# Altium project kookwekker.PrjPcb
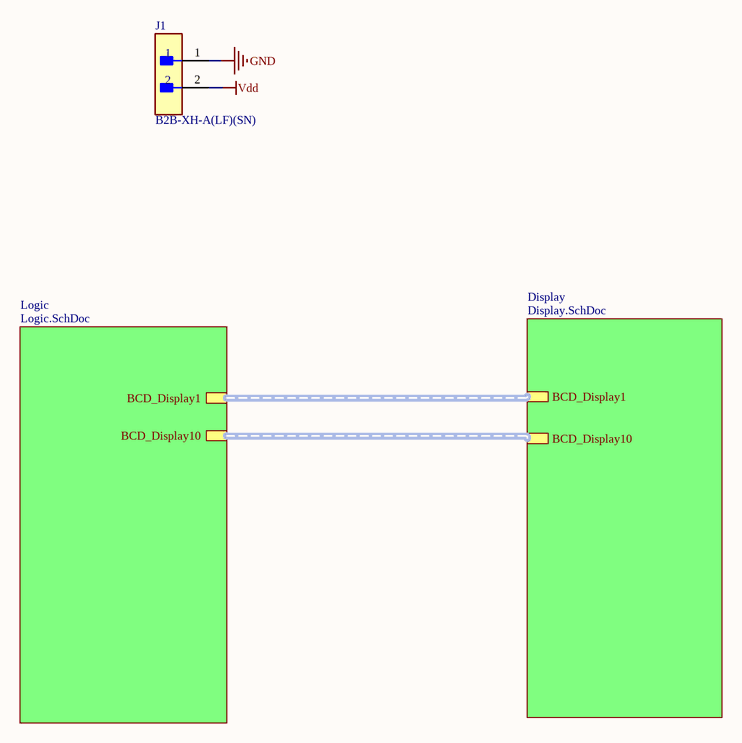
[diagram p0: KookWekker.SchDoc]
3 sheets, 36 parts. Net scope: hierarchical (ports join the sheet entries above them; power ports are global).
Board files: PCB2.PcbDoc, PCB1.PcbDoc
Sheets:
  KookWekker.SchDoc
    Logic = Logic.SchDoc
    Display = Display.SchDoc

## Sheet KookWekker.SchDoc: Kookwekker
size A4; Author: Fabian Eppens; DrawnBy: Fabian Eppens; Revision: 1.0; SheetNumber: 1; SheetTotal: 3

### Parts
J1  B2B-XH-A(LF)(SN)  [FP-B2B-XH-A_LF_SN-MFG]

### Sub-sheets
Display = Display.SchDoc: BCD_Display1 (harness BCD1), BCD_Display10 (harness BCD10)
Logic = Logic.SchDoc: BCD_Display1 (harness BCD1), BCD_Display10 (harness BCD10)

### Nets
GND: J1.1
Vdd: J1.2

### Buses and harness runs
harness sheet Display/BCD_Display1 = sheet Logic/BCD_Display1
harness sheet Display/BCD_Display10 = sheet Logic/BCD_Display10

### Notes on the sheet
- Size:
- Date:
- Drawn by:
- Revision:
- Hogeschool Windesheim
- Campus 2-6
- Postbus 10090
- A4
- Sheet
- of
- 8000GB, Zwolle

### Library data of the parts
J1 = CMP-2000-05888-3: CONN HEADER VERT 2POS 2.5MM; Current Rating: 3A; Voltage Rating: 250V; Number of Contacts: 2; Contact Resistance: 20mR; Wire/Cable Gauge: 22AWG; Insulation Resistance: 1GR; Connector Type: Male Pin; Packaging: Bulk; Contact Material: Brass; Lead Free: Lead Free; Orientation: Straight; Contact Plating: Tin; Max Current Rating: 3A; Termination: Solder; Fastening Type: Detent; Depth: 5.75mm; Housing Material: Polyamide; REACH SVHC: No SVHC; Series: XH; Voltage Rating (AC): 250V; Number of Positions: 2; Color: Natural; Contact Type: Male Pin; Max Voltage Rating (DC): 250V; Pitch: 2.5mm; Lead Pitch: 2.5mm; Mount: Through Hole; Max Operating Temperature: 85°C; Length: 7.4mm; Max Voltage Rating (AC): 250V; Min Operating Temperature: -25°C; Number of Rows: 1; Housing Color: White

## Sheet Logic.SchDoc: Kookwekker
size A4; Author: Fabian Eppens; DrawnBy: Fabian Eppens; Revision: 1.0; SheetNumber: 2; SheetTotal: 3
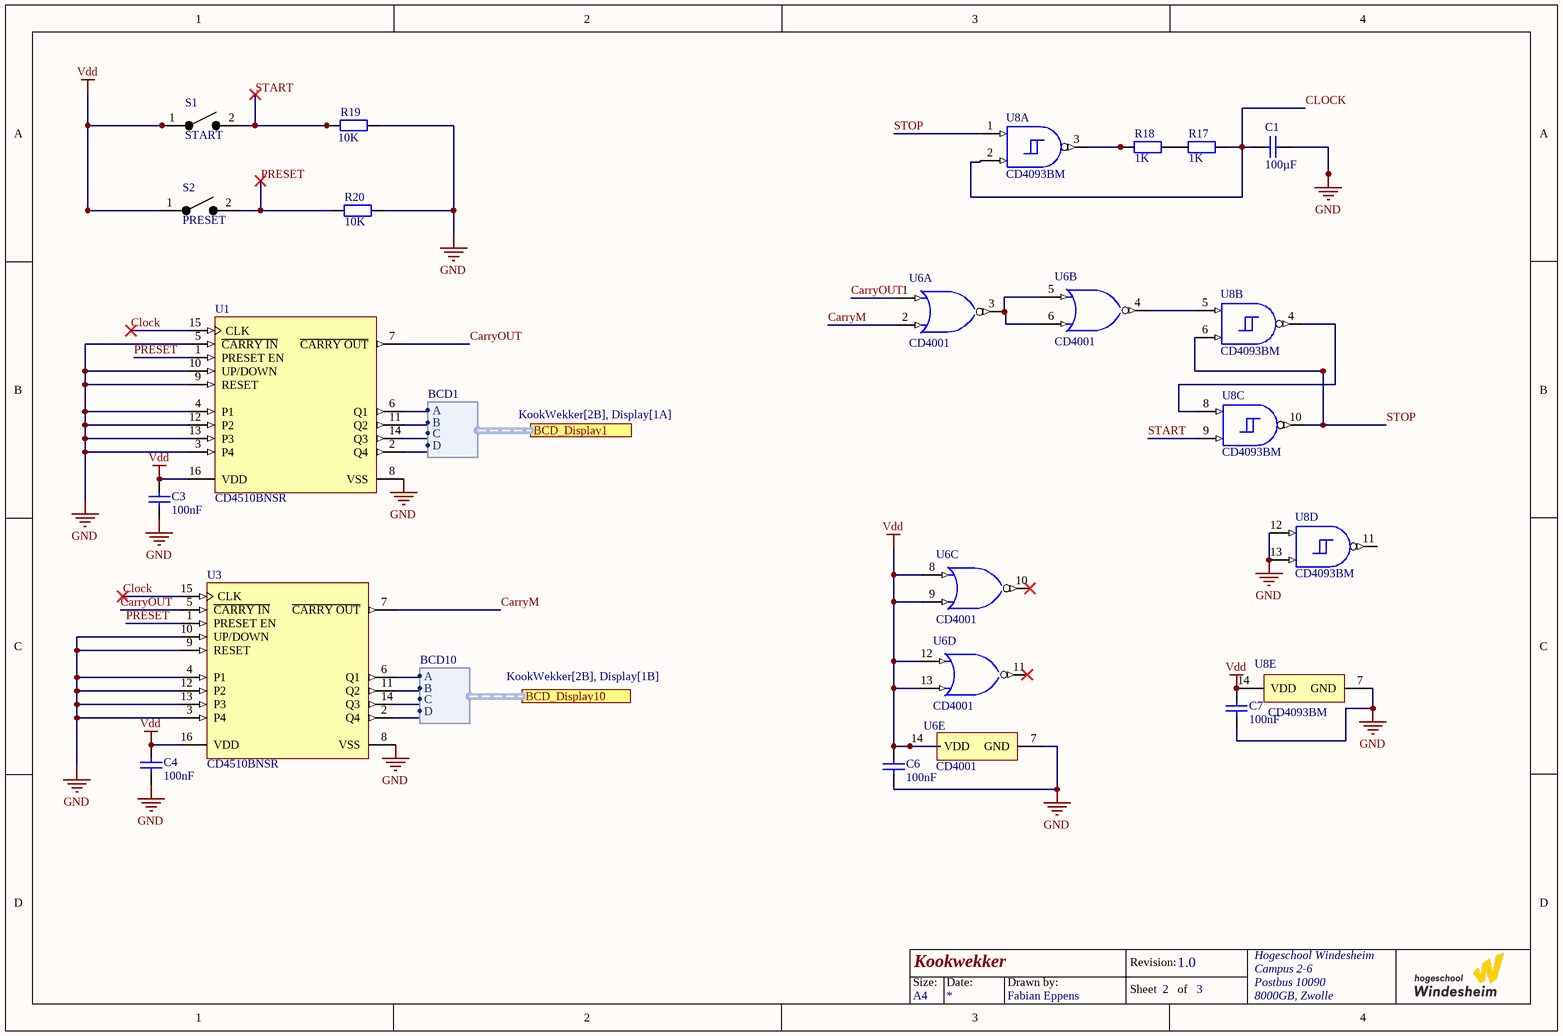
[diagram p1: Logic.SchDoc]

### Parts
C1  100µF  [C1206]
C3  100nF  [C1206]
C4  100nF  [C1206]
C6  100nF  [C1206]
C7  100nF  [C1206]
R17  1K  [R1206]
R18  1K  [R1206]
R19  10K  [R1206]
R20  10K  [R1206]
S1  START  [1478731]
S2  PRESET  [1478731]
U1  CD4510BNSR  [NS0016A_N]
U3  CD4510BNSR  [NS0016A_N]
U6  CD4001  [D0014A_N]  (parts A,B,C,D,E of 5)
U8  CD4093BM  [D0014A_N]  (parts A,B,C,D,E of 5)

### Ports
BCD_Display1 (harness BCD1, see KookWekker[2B], Display[1A]), BCD_Display10 (harness BCD10, see KookWekker[2B], Display[1B])

### Harnesses
BCD1: A, B, C, D
BCD10: A, B, C, D

### Nets
GND: C1.2 C3.2 C4.2 C6.1 C7.1 R19.2 R20.2 U1.3(P4) U1.4(P1) U1.5(~{CARRY_IN}) U1.8(VSS) U1.9(RESET) U1.10(UP/DOWN) U1.12(P2) U1.13(P3) U3.3(P4) U3.4(P1) U3.8(VSS) U3.9(RESET) U3.10(UP/DOWN) U3.12(P2) U3.13(P3) U6.7(GND) U8.7(GND) U8.12(G) U8.13(H)
Vdd: C3.1 C4.1 C6.2 C7.2 S1.1 S2.1 U1.16(VDD) U3.16(VDD) U6.8(E) U6.9(F) U6.12(G) U6.13(H) U6.14(VDD) U8.14(VDD)
CarryM: U3.7(~{CARRY_OUT}) U6.2(B)
CarryOUT: U1.7(~{CARRY_OUT}) U3.5(~{CARRY_IN}) U6.1(A)
Clock: C1.1 R17.2 U1.15(CLK) U3.15(CLK) U8.2(B)
PRESET: R20.1 S2.2 U1.1(PRESET_EN) U3.1(PRESET_EN)
START: R19.1 S1.2 U8.9(F)
STOP: U8.1(A) U8.6(D) U8.10(L)
NetR17_1: R17.1 R18.2
NetR18_1: R18.1 U8.3(J)
NetU1_2: U1.2(Q4) ; port BCD_Display1.D
NetU1_6: U1.6(Q1) ; port BCD_Display1.A
NetU1_11: U1.11(Q2) ; port BCD_Display1.B
NetU1_14: U1.14(Q3) ; port BCD_Display1.C
NetU3_2: U3.2(Q4) ; port BCD_Display10.D
NetU3_6: U3.6(Q1) ; port BCD_Display10.A
NetU3_11: U3.11(Q2) ; port BCD_Display10.B
NetU3_14: U3.14(Q3) ; port BCD_Display10.C
NetU6_3: U6.3(J) U6.5(C) U6.6(D)
NetU6_4: U6.4(K) U8.5(C)
NetU8_4: U8.4(K) U8.8(E)

Not connected (* = marked no-connect by the designer): U6 10(L)* 11(M)*; U8 11(M)

### Notes on the sheet
- Size:
- Date:
- Drawn by:
- Revision:
- Hogeschool Windesheim
- Campus 2-6
- Postbus 10090
- A4
- Sheet
- of
- 8000GB, Zwolle

### Library data of the parts
C1 C3 C4 C6 C7 = Capacitor_1206: SMD Capacitor 1206; Published: 03-11-2016; LatestRevisionDate: 03-11-2016; LatestRevisionNote: Creation; PackageReference: C1206; Publisher: Windesheim; PackageDescription: Chip Capacitor, Body 3.2x1.6mm, Height 1.7mm, IPC Medium Density
  C1: Value: 100µF
  C3 C4 C6 C7: Value: 100nF
R17-R20 = Resistor_1206: SMD Resistor 1206; Published: 03-11-2016; LatestRevisionDate: 03-11-2016; LatestRevisionNote: Creation; PackageReference: R1206; Publisher: Windesheim; PackageDescription: Chip Resistor, Body 3.2x1.6mm, IPC Medium Density
  R17 R18: Value: 1K
  R19 R20: Value: 10K
S1 S2 = Switch: Manufacturer_Name: TE Connectivity; Manufacturer_Part_Number: 147873-1; Datasheet Link: https://componentsearchengine.com/Datasheets/1/147873-1.pdf; Height: 5mm; Mouser Part Number: 506-147873-1; Mouser Price/Stock: https://www.mouser.com/Search/Refine.aspx?Keyword=506-147873-1
U1 U3 = CD4510BNSR: CMOS Presettable BCD Up/Down Counter, NS0016A, LARGE T&R; Manufacturer: Texas Instruments; Bits(#): 4; VCC(Min)(V): 3; Voltage(Nom)(V): 5,10,15; Schmitt Trigger: No; Output Drive (IOL/IOH)(Max)(mA): 1.5/-1.5; Rating: Catalog; Inputs: 1; VCC(Max)(V): 18; Technology Family: CD4000; F @ Nom Voltage(Max)(Mhz): 8; ICC @ Nom Voltage(Max)(mA): 0.03; tpd @ Nom Voltage(Max)(ns): 200; PackageReference: NS0016A; DatasheetVersion: SCHS071B; Generic Part Number: CD4510B; Operating Temperature Range(C): -55 to 125; Output Type: CMOS; Input Type: CMOS; Type: Other; Function: Counter
U6 = CD4001: CMOS Quad 2-Input NOR Schmitt Triggers, D0014A, TUBE; Generic Part Number: CD4093B; Manufacturer: Texas Instruments; Output Drive (IOL/IOH)(Max)(mA): 1.5/-1.5; VCC(Min)(V): 3; Rating: Catalog; Schmitt Trigger: Yes; Voltage(Nom)(V): 10; F @ Nom Voltage(Max)(Mhz): 8; ICC @ Nom Voltage(Max)(mA): 0.06; Bits(#): 4; VCC(Max)(V): 18; Technology Family: CD4000; DatasheetVersion: SCHS115D; Code_JEDEC: MS-012; Operating Temperature Range(C): -55 to 125; Output Type: CMOS; PackageReference: D0014A; Input Type: CMOS
U8 = CD4093BM: CMOS Quad 2-Input NAND Schmitt Triggers, D0014A, TUBE; Manufacturer: Texas Instruments; Output Drive (IOL/IOH)(Max)(mA): 1.5/-1.5; VCC(Min)(V): 3; Rating: Catalog; Schmitt Trigger: Yes; Voltage(Nom)(V): 10; F @ Nom Voltage(Max)(Mhz): 8; ICC @ Nom Voltage(Max)(mA): 0.06; Bits(#): 4; VCC(Max)(V): 18; Technology Family: CD4000; Generic Part Number: CD4093B; DatasheetVersion: SCHS115D; Code_JEDEC: MS-012; Operating Temperature Range(C): -55 to 125; Output Type: CMOS; PackageReference: D0014A; Input Type: CMOS

## Sheet Display.SchDoc: Kookwekker
size A4; Author: Fabian Eppens; DrawnBy: Fabian Eppes; Revision: 1.0; SheetNumber: 3; SheetTotal: 3
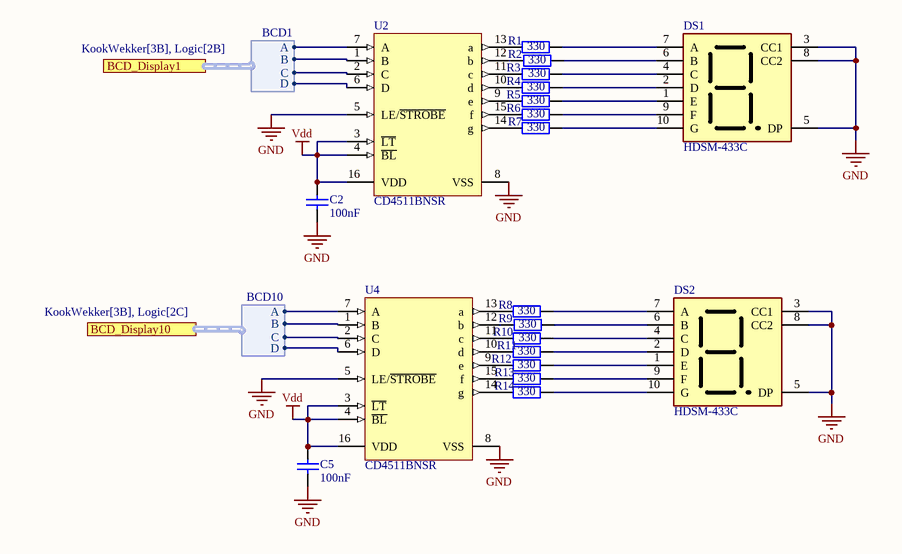
[diagram p2: Display.SchDoc]

### Parts
C2  100nF  [C1206]
C5  100nF  [C1206]
DS1  HDSM-433C  [HDSM433C]
DS2  HDSM-433C  [HDSM433C]
R1  330  [R1206]
R2  330  [R1206]
R3  330  [R1206]
R4  330  [R1206]
R5  330  [R1206]
R6  330  [R1206]
R7  330  [R1206]
R8  330  [R1206]
R9  330  [R1206]
R10  330  [R1206]
R11  330  [R1206]
R12  330  [R1206]
R13  330  [R1206]
R14  330  [R1206]
U2  CD4511BNSR  [TI-NS16_N]
U4  CD4511BNSR  [TI-NS16_N]

### Ports
BCD_Display1 (harness BCD1, see KookWekker[3B], Logic[2B]), BCD_Display10 (harness BCD10, see KookWekker[3B], Logic[2C])

### Harnesses
BCD1: A, B, C, D
BCD10: A, B, C, D

### Nets
GND: C2.1 C5.1 DS1.3(CC1) DS1.5(DP) DS1.8(CC2) DS2.3(CC1) DS2.5(DP) DS2.8(CC2) U2.5(LE/~{STROBE}) U2.8(VSS) U4.5(LE/~{STROBE}) U4.8(VSS)
Vdd: C2.2 C5.2 U2.3(~{LT}) U2.4(~{BL}) U2.16(VDD) U4.3(~{LT}) U4.4(~{BL}) U4.16(VDD)
NetDS1_1: DS1.1(E) R5.2
NetDS1_2: DS1.2(D) R4.2
NetDS1_4: DS1.4(C) R3.2
NetDS1_6: DS1.6(B) R2.2
NetDS1_7: DS1.7(A) R1.2
NetDS1_9: DS1.9(F) R6.2
NetDS1_10: DS1.10(G) R7.2
NetDS2_1: DS2.1(E) R12.2
NetDS2_2: DS2.2(D) R11.2
NetDS2_4: DS2.4(C) R10.2
NetDS2_6: DS2.6(B) R9.2
NetDS2_7: DS2.7(A) R8.2
NetDS2_9: DS2.9(F) R13.2
NetDS2_10: DS2.10(G) R14.2
NetR1_1: R1.1 U2.13(a)
NetR2_1: R2.1 U2.12(b)
NetR3_1: R3.1 U2.11(c)
NetR4_1: R4.1 U2.10(d)
NetR5_1: R5.1 U2.9(e)
NetR6_1: R6.1 U2.15(f)
NetR7_1: R7.1 U2.14(g)
NetR8_1: R8.1 U4.13(a)
NetR9_1: R9.1 U4.12(b)
NetR10_1: R10.1 U4.11(c)
NetR11_1: R11.1 U4.10(d)
NetR12_1: R12.1 U4.9(e)
NetR13_1: R13.1 U4.15(f)
NetR14_1: R14.1 U4.14(g)
NetU1_2: U2.6(D) ; port BCD_Display1.D
NetU1_6: U2.7(A) ; port BCD_Display1.A
NetU1_11: U2.1(B) ; port BCD_Display1.B
NetU1_14: U2.2(C) ; port BCD_Display1.C
NetU3_2: U4.6(D) ; port BCD_Display10.D
NetU3_6: U4.7(A) ; port BCD_Display10.A
NetU3_11: U4.1(B) ; port BCD_Display10.B
NetU3_14: U4.2(C) ; port BCD_Display10.C

### Notes on the sheet
- Size:
- Date:
- Drawn by:
- Revision:
- Hogeschool Windesheim
- Campus 2-6
- Postbus 10090
- A4
- Sheet
- of
- 8000GB, Zwolle

### Library data of the parts
C2 C5 = Capacitor_1206: SMD Capacitor 1206; Published: 03-11-2016; LatestRevisionDate: 03-11-2016; LatestRevisionNote: Creation; PackageReference: C1206; Publisher: Windesheim; PackageDescription: Chip Capacitor, Body 3.2x1.6mm, Height 1.7mm, IPC Medium Density; Value: 100nF
DS1 DS2 = HDSM-433C: Display; Manufacturer_Name: Avago Technologies; Datasheet Link: https://docs.broadcom.com/docs/AV02-0708EN; Height: 4mm; Manufacturer_Part_Number: HDSM-433C; Mouser Part Number: 630-HDSM-433C; Mouser Price/Stock: https://www.mouser.com/Search/Refine.aspx?Keyword=630-HDSM-433C; RS Part Number: 1783057; RS Price/Stock: http://uk.rs-online.com/web/p/products/1783057
R1-R14 = Resistor_1206: SMD Resistor 1206; Published: 03-11-2016; LatestRevisionDate: 03-11-2016; LatestRevisionNote: Creation; PackageReference: R1206; Publisher: Windesheim; PackageDescription: Chip Resistor, Body 3.2x1.6mm, IPC Medium Density; Value: 330
U2 U4 = CD4511BNSR: CMOS BCD-to-7-Segment LED Latch / Decoder / Driver, 3 to 18 V, -55 to 125 degC, 16-pin SOP (NS16), Green (RoHS & no Sb/Br); Manufacturer: Texas Instruments; Vin(Max)(V): 18; Rating: Military; Vin(Min)(V): 3; SubFamily: Discrete Segment LED Driver; ComponentLink3URL: http://www.ti.com/litv/pdf/msop002a; ComponentLink1Description: Manufacturer URL; PackageReference: NS16; ComponentLink3Description: Package Specification; ComponentLink1URL: http://www.ti.com/; DatasheetVersion: SCHS072B; Mounting Technology: Surface Mount; PartNumber: CD4511BNSR; ComponentLink2Description: Datasheet; PackageVersion: 4040062/C; ComponentLink2URL: http://www.ti.com/general/docs/lit/getliterature.tsp?genericPartNumber=CD4511B&fileType=pdf; Eco-Plan: Green (RoHS & no Sb/Br); PackageDescription: 16-Pin Plastic Small Outline, Body 10.20 x 5.30 mm, Pitch 1.27 mm

## Nets that join several sheets
GND: KookWekker (J1.1), Logic (26 pins), Display (12 pins)
Vdd: KookWekker (J1.2), Logic (14 pins), Display (8 pins)
NetU1_2: Logic (U1.2), Display (U2.6)
NetU1_6: Logic (U1.6), Display (U2.7)
NetU1_11: Logic (U1.11), Display (U2.1)
NetU1_14: Logic (U1.14), Display (U2.2)
NetU3_2: Logic (U3.2), Display (U4.6)
NetU3_6: Logic (U3.6), Display (U4.7)
NetU3_11: Logic (U3.11), Display (U4.1)
NetU3_14: Logic (U3.14), Display (U4.2)